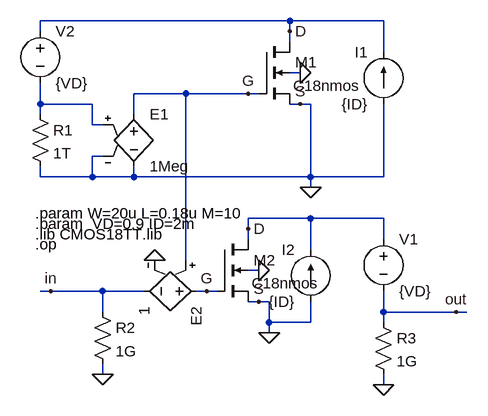
[diagram p0: schematic NMOS-OP-testbench.asc]
NMOS-OP-testbench.asc, the LTspice schematic file:
Version 4
SHEET 1 880 680
WIRE 144 48 -240 48
WIRE 288 48 144 48
WIRE -240 64 -240 48
WIRE 144 64 144 48
WIRE 144 80 144 64
WIRE 288 96 288 48
WIRE 160 128 144 128
WIRE -16 160 -96 160
WIRE 80 160 -16 160
WIRE 96 160 80 160
WIRE -240 176 -240 144
WIRE -160 176 -240 176
WIRE 160 176 144 176
WIRE 176 176 160 176
WIRE -240 192 -240 176
WIRE -96 192 -96 160
WIRE -160 208 -160 176
WIRE -144 208 -160 208
WIRE -144 256 -160 256
WIRE -240 288 -240 272
WIRE -160 288 -160 256
WIRE -160 288 -240 288
WIRE -96 288 -96 272
WIRE -96 288 -160 288
WIRE 176 288 176 176
WIRE 176 288 -96 288
WIRE 288 288 288 176
WIRE 288 288 176 288
WIRE 176 304 176 288
WIRE 176 352 80 352
WIRE 288 352 176 352
WIRE 80 368 80 352
WIRE 80 384 80 368
WIRE 288 384 288 352
WIRE 176 400 176 352
WIRE -16 416 -16 160
WIRE 96 432 80 432
WIRE -224 464 -240 464
WIRE -144 464 -224 464
WIRE -80 464 -144 464
WIRE 16 464 0 464
WIRE 32 464 16 464
WIRE 96 480 80 480
WIRE 112 480 96 480
WIRE -144 496 -144 464
WIRE 288 496 288 464
WIRE 400 496 288 496
WIRE 416 496 400 496
WIRE 112 512 112 480
WIRE 176 512 176 480
WIRE 176 512 112 512
WIRE 288 512 288 496
WIRE 112 528 112 512
WIRE -144 592 -144 576
WIRE 288 608 288 592
FLAG 176 304 0
FLAG 160 128 0
FLAG 80 160 G
FLAG 160 176 S
FLAG 144 64 D
FLAG -64 416 0
FLAG 112 528 0
FLAG 96 432 0
FLAG 16 464 G
FLAG 96 480 S
FLAG 80 368 D
FLAG 288 608 0
FLAG -144 592 0
FLAG 400 496 out
FLAG -224 464 in
DATAFLAG -208 464 ""
DATAFLAG 352 496 ""
SYMBOL nmos4 96 80 R0
WINDOW 3 53 68 Left 2
SYMATTR Value C18nmos
SYMATTR InstName M1
SYMATTR Value2 l={L} w={W} m={M}
SYMBOL voltage -240 48 R0
SYMATTR InstName V2
SYMATTR Value {VD}
SYMBOL current 288 176 R180
WINDOW 0 24 80 Left 2
WINDOW 3 24 0 Left 2
SYMATTR InstName I1
SYMATTR Value {ID}
SYMBOL e -96 176 R0
SYMATTR InstName E1
SYMATTR Value 1Meg
SYMBOL res -256 176 R0
SYMATTR InstName R1
SYMATTR Value 1T
SYMBOL e 16 464 R90
SYMATTR InstName E2
SYMATTR Value 1
SYMBOL nmos4 32 384 R0
WINDOW 3 53 68 Left 2
SYMATTR Value C18nmos
SYMATTR InstName M2
SYMATTR Value2 l={L} w={W} m={M}
SYMBOL current 176 480 R180
WINDOW 0 24 80 Left 2
WINDOW 3 24 0 Left 2
SYMATTR InstName I2
SYMATTR Value {ID}
SYMBOL voltage 288 368 R0
SYMATTR InstName V1
SYMATTR Value {VD}
SYMBOL res -160 480 R0
SYMATTR InstName R2
SYMATTR Value 1G
SYMBOL res 272 496 R0
SYMATTR InstName R3
SYMATTR Value 1G
TEXT -248 344 Left 2 !.param W=20u L=0.18u M=10
TEXT -248 360 Left 2 !.param  VD=0.9 ID=2m
TEXT -248 376 Left 2 !.lib CMOS18TT.lib
TEXT -248 392 Left 2 !.op

The netlist it stands for:
* NMOS-OP-testbench.asc
M1 D G 0 0 C18nmos l={L} w={W} m={M}
V2 D N001 {VD}
I1 0 D {ID}
E1 G 0 N001 0 1Meg
R1 N001 0 1T
E2 G in G 0 1
M2 D G 0 0 C18nmos l={L} w={W} m={M}
I2 0 D {ID}
V1 D out {VD}
R2 in 0 1G
R3 out 0 1G
.model NMOS NMOS
.model PMOS PMOS
.lib standard.mos
.param W=20u L=0.18u M=10
.param  VD=0.9 ID=2m
.lib CMOS18TT.lib
.op
.backanno
.end